# Altium project TMP100_SMD_TO_HDR.PrjPcb
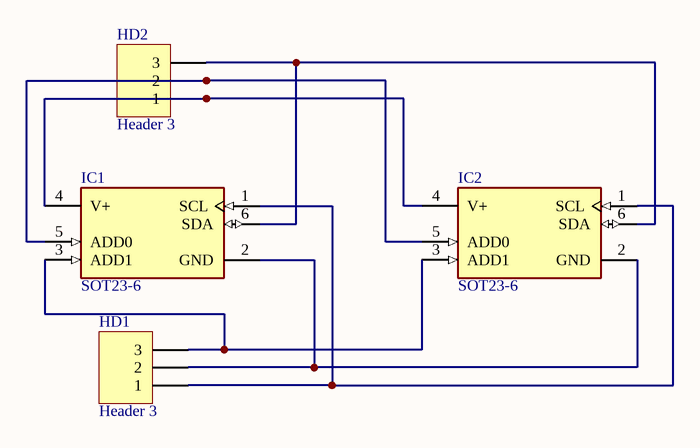
[diagram p0: TMP100_SMD_TO_HDR.SchDoc]
1 sheet, 4 parts. Net scope: global (net labels, ports and power ports of the same name join across sheets).
Board file: TMP100_SMD_TO_HDR.PcbDoc

## Sheet TMP100_SMD_TO_HDR.SchDoc
size C; SheetNumber: 1; SheetTotal: 1

### Parts
HD1  Header 3  [HDR1X3]
HD2  Header 3  [HDR1X3]
IC1  SOT23-6  [FP-DBV0006A-MFG]
IC2  SOT23-6  [FP-DBV0006A-MFG]

### Nets
NetHD1_1: HD1.1 IC1.1(SCL) IC2.1(SCL)
NetHD1_2: HD1.2 IC1.2(GND) IC2.2(GND)
NetHD1_3: HD1.3 IC1.3(ADD1) IC2.3(ADD1)
NetHD2_1: HD2.1 IC1.4(V+) IC2.4(V+)
NetHD2_2: HD2.2 IC1.5(ADD0) IC2.5(ADD0)
NetHD2_3: HD2.3 IC1.6(SDA) IC2.6(SDA)

### Library data of the parts
HD1 HD2 = Header 3: Header, 3-Pin; LatestRevisionDate: 17-Jul-2002; LatestRevisionNote: Re-released for DXP Platform.; Publisher: Altium Limited
IC1 IC2 = CMP-04948-000006-1: SENSOR DIGITAL -55C-125C SOT23-6; Manufacturer Part Number: TMP100NA/3K; Manufacturer: Texas Instruments; Max Junction Temp: +150°C; Min Supply Voltage: 2.7V; Max Supply Voltage: 5.5V; Interface: I2C,2-Wire,SMBus; Standoff Height: 0mm; Sensor Output: I2C,SMBus; Resolution: 12bits; Operating Supply Current: 45-150uA; Height: 1.45mm; Device Class L2: Temperature and Humidity Sensors; Digikey Description: SENSOR DIGITAL -55C-125C SOT23-6; RoHS: TRUE; ComponentLink2Description: Datasheet; Lead Free: Yes; Automotive: No; Device Class L1: Sensors; Temperature Range Low: -55°C; Device Class L3: unset; Octopart: https://octopart.com/tmp100na%2F3k-texas+instruments-848964; ComponentLink2URL: http://www.ti.com/lit/ds/symlink/tmp100.pdf; Category: IC; Mouser Description: Board Mount Temperature Sensors Digital Temp Sensor w/I2C Ser Interface; Package: DBV0006A; Ipc Land Pattern Name: SOT95P280X145-6; Temperature Range High: +125°C; Ambient Temperature Range Low: -55°C; Temperature: -55°C to +125°C; Ambient Temperature Range High: +125°C